# Altium schematic sheet SAO_Area3001_L_WS2812_00.SchDoc: SAO.69 AREA 3001 Large
size A3; Date: 24/06/2019; DrawnBy: Wim Van Gool; DocumentNumber: 1; Revision: 00; SheetNumber: 1; SheetTotal: 1
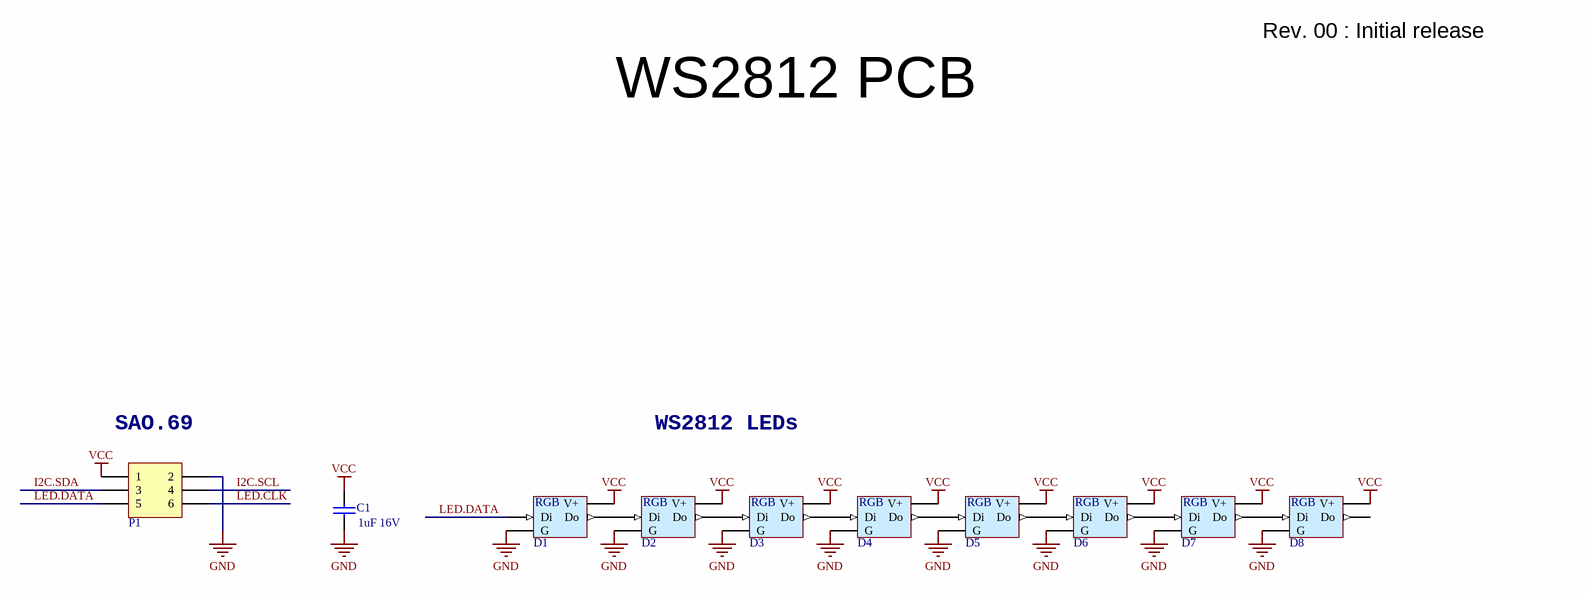
[diagram p0: SAO_Area3001_L_WS2812_00.SchDoc]

## Parts
C1  value 1uF 16V  [C0603_N]  (hidden comment: CAP_CERAMIC)
D1  WS2812 based digital RGB LED 5050 White package  [LED_5050_WS2812B_WHITE]  (value not drawn)
D2  WS2812 based digital RGB LED 5050 White package  [LED_5050_WS2812B_WHITE]  (value not drawn)
D3  WS2812 based digital RGB LED 5050 White package  [LED_5050_WS2812B_WHITE]  (value not drawn)
D4  WS2812 based digital RGB LED 5050 White package  [LED_5050_WS2812B_WHITE]  (value not drawn)
D5  WS2812 based digital RGB LED 5050 White package  [LED_5050_WS2812B_WHITE]  (value not drawn)
D6  WS2812 based digital RGB LED 5050 White package  [LED_5050_WS2812B_WHITE]  (value not drawn)
D7  WS2812 based digital RGB LED 5050 White package  [LED_5050_WS2812B_WHITE]  (value not drawn)
D8  WS2812 based digital RGB LED 5050 White package  [LED_5050_WS2812B_WHITE]  (value not drawn)
P1  Boxed Header 3X2  [B_HDR2X3]  (value not drawn)

## Nets
GND: C1.2 D1.3(G) D2.3(G) D3.3(G) D4.3(G) D5.3(G) D6.3(G) D7.3(G) D8.3(G) P1.2
VCC: C1.1 D1.1(V+) D2.1(V+) D3.1(V+) D4.1(V+) D5.1(V+) D6.1(V+) D7.1(V+) D8.1(V+) P1.1
I2C.SCL: P1.4
I2C.SDA: P1.3
LED.CLK: P1.6
LED.DATA: D1.4(Di) P1.5
NetD1_2: D1.2(Do) D2.4(Di)
NetD2_2: D2.2(Do) D3.4(Di)
NetD3_2: D3.2(Do) D4.4(Di)
NetD4_2: D4.2(Do) D5.4(Di)
NetD5_2: D5.2(Do) D6.4(Di)
NetD6_2: D6.2(Do) D7.4(Di)
NetD7_2: D7.2(Do) D8.4(Di)

Not connected (* = marked no-connect by the designer): D8 2(Do)

## Notes on the sheet
- Rev. 00 : Initial release
- WS2812 PCB
- (near P1) SAO.69
- WS2812 LEDs
- Title
- Revision
- Date
- Dranw By
- Size
- A3
- Sheet
- of
- (in symbol LED # RGB WS2812B-5050 WH) RGB

## Library data of the parts
C1 = CAP # 1uF 16V 0603: Capacitor Ceramic; Supplier 1: Farnell; Supplier Part Number 1: 2320814
D1-D8 = LED # RGB WS2812B-5050 WH: =Description; Value: WS218B 5050 WH; Supplier 1: Aliexpress; Supplier Part Number 1: WS2812B White 5050
P1 = Pin Header 2.54mm dual row 6way Boxed